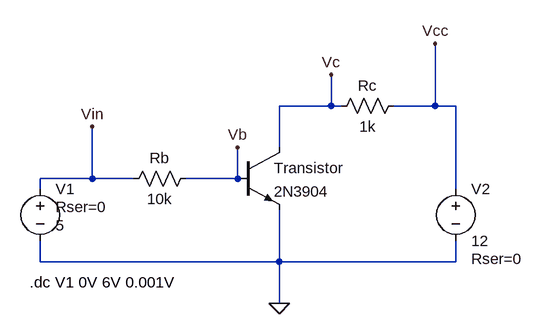
[diagram p0: schematic Transistor as a switch.asc]
Transistor as a switch.asc, the LTspice schematic file:
Version 4
SHEET 1 880 680
WIRE 176 0 176 -48
WIRE 176 0 96 0
WIRE 192 0 176 0
WIRE 336 0 336 -96
WIRE 336 0 272 0
WIRE 368 0 336 0
WIRE 96 64 96 0
WIRE -192 112 -192 32
WIRE -192 112 -272 112
WIRE -128 112 -192 112
WIRE 32 112 32 64
WIRE 32 112 -48 112
WIRE -272 128 -272 112
WIRE 368 128 368 0
WIRE -272 240 -272 208
WIRE 96 240 96 160
WIRE 96 240 -272 240
WIRE 368 240 368 208
WIRE 368 240 96 240
WIRE 96 304 96 240
FLAG 96 304 0
FLAG 32 64 Vb
FLAG 176 -48 Vc
FLAG -192 32 Vin
FLAG 336 -96 Vcc
SYMBOL voltage 368 112 R0
WINDOW 123 0 0 Left 0
WINDOW 39 24 124 Left 2
SYMATTR SpiceLine Rser=0
SYMATTR InstName V2
SYMATTR Value 12
SYMBOL voltage -272 112 R0
WINDOW 123 0 0 Left 0
WINDOW 39 24 44 Left 2
WINDOW 3 24 72 Left 2
SYMATTR SpiceLine Rser=0
SYMATTR Value 5
SYMATTR InstName V1
SYMBOL res 288 -16 R90
WINDOW 0 0 56 VBottom 2
WINDOW 3 32 56 VTop 2
SYMATTR InstName Rc
SYMATTR Value 1k
SYMBOL res -32 96 R90
WINDOW 0 0 56 VBottom 2
WINDOW 3 32 56 VTop 2
SYMATTR InstName Rb
SYMATTR Value 10k
SYMBOL npn 32 64 R0
SYMATTR InstName Transistor
SYMATTR Value 2N3904
TEXT -288 272 Left 2 !.dc V1 0V 6V 0.001V

The netlist it stands for:
* Transistor as a switch.asc
V2 Vcc 0 12 Rser=0
V1 Vin 0 5 Rser=0
Rc Vcc Vc 1k
Rb Vb Vin 10k
Q§Transistor Vc Vb 0 0 2N3904
.model NPN NPN
.model PNP PNP
.lib standard.bjt
.dc V1 0V 6V 0.001V
.backanno
.end